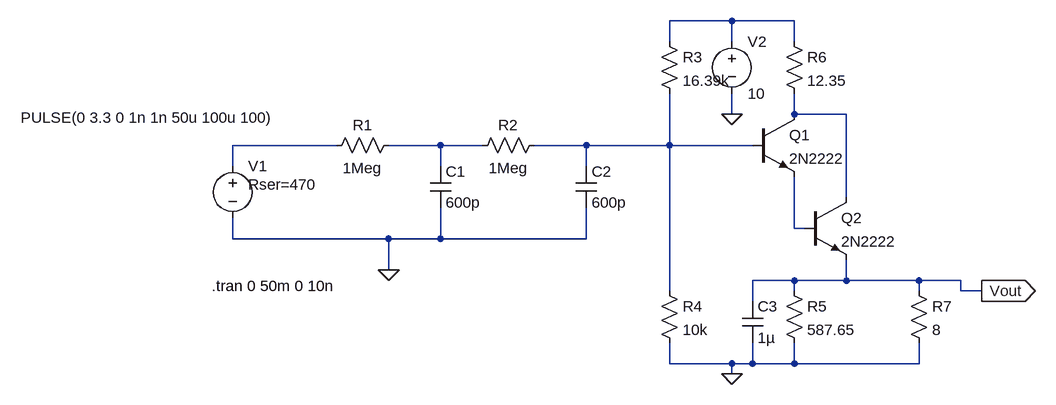
[diagram p0: schematic Draft1.asc]
Draft1.asc, the LTspice schematic file:
Version 4
SHEET 1 928 680
WIRE 432 -144 336 -144
WIRE 528 -144 432 -144
WIRE 336 -112 336 -144
WIRE 432 -112 432 -144
WIRE 528 -112 528 -144
WIRE 432 0 432 -32
WIRE 528 0 528 -32
WIRE 608 0 528 0
WIRE -176 48 -336 48
WIRE -16 48 -96 48
WIRE 48 48 -16 48
WIRE 208 48 128 48
WIRE 336 48 336 -32
WIRE 336 48 208 48
WIRE 464 48 336 48
WIRE -336 80 -336 48
WIRE -16 80 -16 48
WIRE 208 80 208 48
WIRE 608 128 608 0
WIRE 528 176 528 96
WIRE 544 176 528 176
WIRE -336 192 -336 160
WIRE -96 192 -336 192
WIRE -16 192 -16 144
WIRE -16 192 -96 192
WIRE 208 192 208 144
WIRE 208 192 -16 192
WIRE -96 240 -96 192
WIRE 528 256 464 256
WIRE 608 256 608 224
WIRE 608 256 528 256
WIRE 720 256 608 256
WIRE 784 256 720 256
WIRE 336 272 336 48
WIRE 528 272 528 256
WIRE 720 272 720 256
WIRE 784 272 784 256
WIRE 816 272 784 272
WIRE 464 288 464 256
WIRE 336 384 336 352
WIRE 432 384 336 384
WIRE 464 384 464 352
WIRE 464 384 432 384
WIRE 528 384 528 352
WIRE 528 384 464 384
WIRE 720 384 720 352
WIRE 720 384 528 384
WIRE 432 400 432 384
FLAG -96 240 0
FLAG 432 400 0
FLAG 432 0 0
FLAG 816 272 Vout
IOPIN 816 272 Out
SYMBOL voltage -336 64 R0
WINDOW 123 0 0 Left 2
WINDOW 39 24 44 Left 2
WINDOW 3 -326 -59 Left 2
SYMATTR SpiceLine Rser=470
SYMATTR Value PULSE(0 3.3 0 1n 1n 50u 100u 100)
SYMATTR InstName V1
SYMBOL res -80 32 R90
WINDOW 0 0 56 VBottom 2
WINDOW 3 35 56 VTop 2
SYMATTR InstName R1
SYMATTR Value 1Meg
SYMBOL cap -32 80 R0
SYMATTR InstName C1
SYMATTR Value 600p
SYMBOL res 144 32 R90
WINDOW 0 0 56 VBottom 2
WINDOW 3 35 56 VTop 2
SYMATTR InstName R2
SYMATTR Value 1Meg
SYMBOL cap 192 80 R0
SYMATTR InstName C2
SYMATTR Value 600p
SYMBOL npn 464 0 R0
SYMATTR InstName Q1
SYMATTR Value 2N2222
SYMBOL res 320 -128 R0
SYMATTR InstName R3
SYMATTR Value 16.39k
SYMBOL res 320 256 R0
SYMATTR InstName R4
SYMATTR Value 10k
SYMBOL res 512 256 R0
SYMATTR InstName R5
SYMATTR Value 587.65
SYMBOL res 512 -128 R0
SYMATTR InstName R6
SYMATTR Value 12.35
SYMBOL voltage 432 -128 R0
WINDOW 123 0 0 Left 2
WINDOW 39 24 44 Left 2
SYMATTR InstName V2
SYMATTR Value 10
SYMBOL res 704 256 R0
SYMATTR InstName R7
SYMATTR Value 8
SYMBOL cap 448 288 R0
SYMATTR InstName C3
SYMATTR Value 1µ
SYMBOL npn 544 128 R0
SYMATTR InstName Q2
SYMATTR Value 2N2222
TEXT -368 264 Left 2 !.tran 0 50m 0 10n

The netlist it stands for:
* Draft1.asc
V1 N003 0 PULSE(0 3.3 0 1n 1n 50u 100u 100) Rser=470
R1 N004 N003 1Meg
C1 N004 0 600p
R2 N005 N004 1Meg
C2 N005 0 600p
Q1 N002 N005 N006 0 2N2222
R3 N001 N005 16.39k
R4 N005 0 10k
R5 Vout 0 587.65
R6 N001 N002 12.35
V2 N001 0 10
R7 Vout 0 8
C3 Vout 0 1µ
Q2 N002 N006 Vout 0 2N2222
.model NPN NPN
.model PNP PNP
.lib standard.bjt
.tran 0 50m 0 10n
.backanno
.end